# Altium schematic sheet SENSORS.SchDoc: Sensors
size B; Author: Sébastien Gélinas; Organization: SmartHalo; Address1: 5445 de Gaspé; Address2: Montréal, QC; Address3: Canada; Address4: H2T 3B2; DocumentNumber: 2; Revision: 1; SheetNumber: 2; SheetTotal: 4
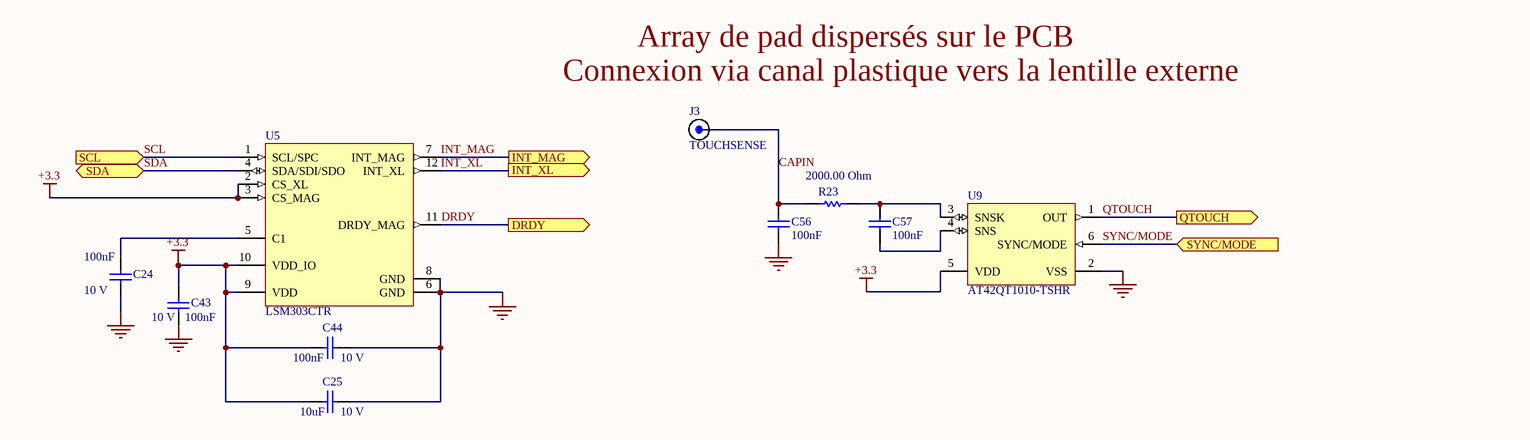
[diagram p0: SENSORS.SchDoc]

## Parts
C24  value 100nF  Rated Voltage: 10 V  [CAPC0402(1005)60_L]  (hidden comment: CAP 100nF 10V 0402(1005))
C25  value 10uF  Rated Voltage: 10 V  [CAPC0603(1608)100_N]  (hidden comment: CAP 10uF 10V 0603(1608))
C43  value 100nF  Rated Voltage: 10 V  [CAPC0402(1005)60_L]  (hidden comment: CAP 100nF 10V 0402(1005))
C44  value 100nF  Rated Voltage: 10 V  [CAPC0402(1005)60_L]  (hidden comment: CAP 100nF 10V 0402(1005))
C56  value 100nF  [CAPC0402(1005)60_L]  (hidden comment: CAP 100nF 10V 0402(1005))
C57  value 100nF  [CAPC0402(1005)60_L]  (hidden comment: CAP 100nF 10V 0402(1005))
J3  TOUCHSENSE  [TOUCHSENSE]  (no BOM)
R23  value 2000.00 Ohm  [RESC0603(1608)_N]  (hidden comment: 2K 5% 0603(1608))
U5  LSM303CTR  [LGA12-2X2X1_N]
U9  AT42QT1010-TSHR  [6ST1_M]

## Ports
DRDY (out), INT_MAG (out), INT_XL (out), QTOUCH (out), SCL (in), SDA (bidir), SYNC/MODE (in)

## Nets
+3.3: C25.2 C43.1 C44.2 U5.2(CS_XL) U5.3(CS_MAG) U5.9(VDD) U5.10(VDD_IO) U9.5(VDD)
GND: C24.2 C25.1 C43.2 C44.1 C56.1 U5.6(GND) U5.8(GND) U9.2(VSS)
CAPIN: C56.2 J3.1 R23.2
DRDY: U5.11(DRDY_MAG) ; port DRDY
INT_MAG: U5.7(INT_MAG) ; port INT_MAG
INT_XL: U5.12(INT_XL) ; port INT_XL
QTOUCH: U9.1(OUT) ; port QTOUCH
SCL: U5.1(SCL/SPC) ; port SCL
SDA: U5.4(SDA/SDI/SDO) ; port SDA
SYNC/MODE: U9.6(SYNC/MODE) ; port SYNC/MODE
NetC24_1: C24.1 U5.5(C1)
NetC57_1: C57.1 U9.4(SNS)
NetC57_2: C57.2 R23.1 U9.3(SNSK)

## Notes on the sheet
- (near J3) Connexion via canal plastique vers la lentille externe
- Array de pad dispersés sur le PCB
- Title
- Size:
- Date:
- B
- Author:
- Time:
- Sheet
- Revision:
- of
- File:

## Library data of the parts
C24 C43 C44 C56 C57 = CMP-1034-02064-1: CAP 100nF 10V Â±5% 0402 (1005 Metric) Thickness 0.6mm SMD; Case-EIA: 0402; Case-Metric: 1005; Max Thickness: 0.6 mm; Tolerance: Â±5%; Technology: SMT
  C56 C57: Rated Voltage: 10 V
C25 = CMP-1035-02799-1: CAP 10uF 10V Â±10% 0603 (1608 Metric) Thickness 1mm SMD; Case-Metric: 1608; Case-EIA: 0603; Max Thickness: 1 mm; Tolerance: Â±10%; Technology: SMT
J3 = TOUCHSENSE: Touch Sensor pad connection
R23 = CMP-1012-00081-1: 2K 0.1W 5% 0603 (1608 Metric)  SMD; Case-Metric: 1608; Case-EIA: 0603; Tolerance: 5 %; Technology: SMT; Power: 0.1 W
U5 = SEN-MOT-LSM303CTR-12: 3D ACCELEROMETER/MAGNETOMETER
U9 = CMP-0073-00038-1: One-channel Touch Sensor IC with Reset Timer, -40Â° to +85Â° C, 6-pin SOT23; DatasheetVersion: revH, May-2010; Code_IPC: SOT26A-6; PackageDescription: 6-Lead, 2.90 x 1.60 mm Plastic Small Outline Package (SOT23); PackageVersion: revA, Jun-2008; PackageReference: 6ST1; ComponentLink2Description: Datasheet; ComponentLink2URL: http://www.atmel.com/Images/doc9541.pdf; ComponentLink1URL: http://www.atmel.com/; ComponentLink1Description: Manufacturer URL; Code_JEDEC: MO-178-AB